# EAGLE schematic openSX70_OUTLINE_SONAR_8_20190606B (EAGLE 9.3.2)
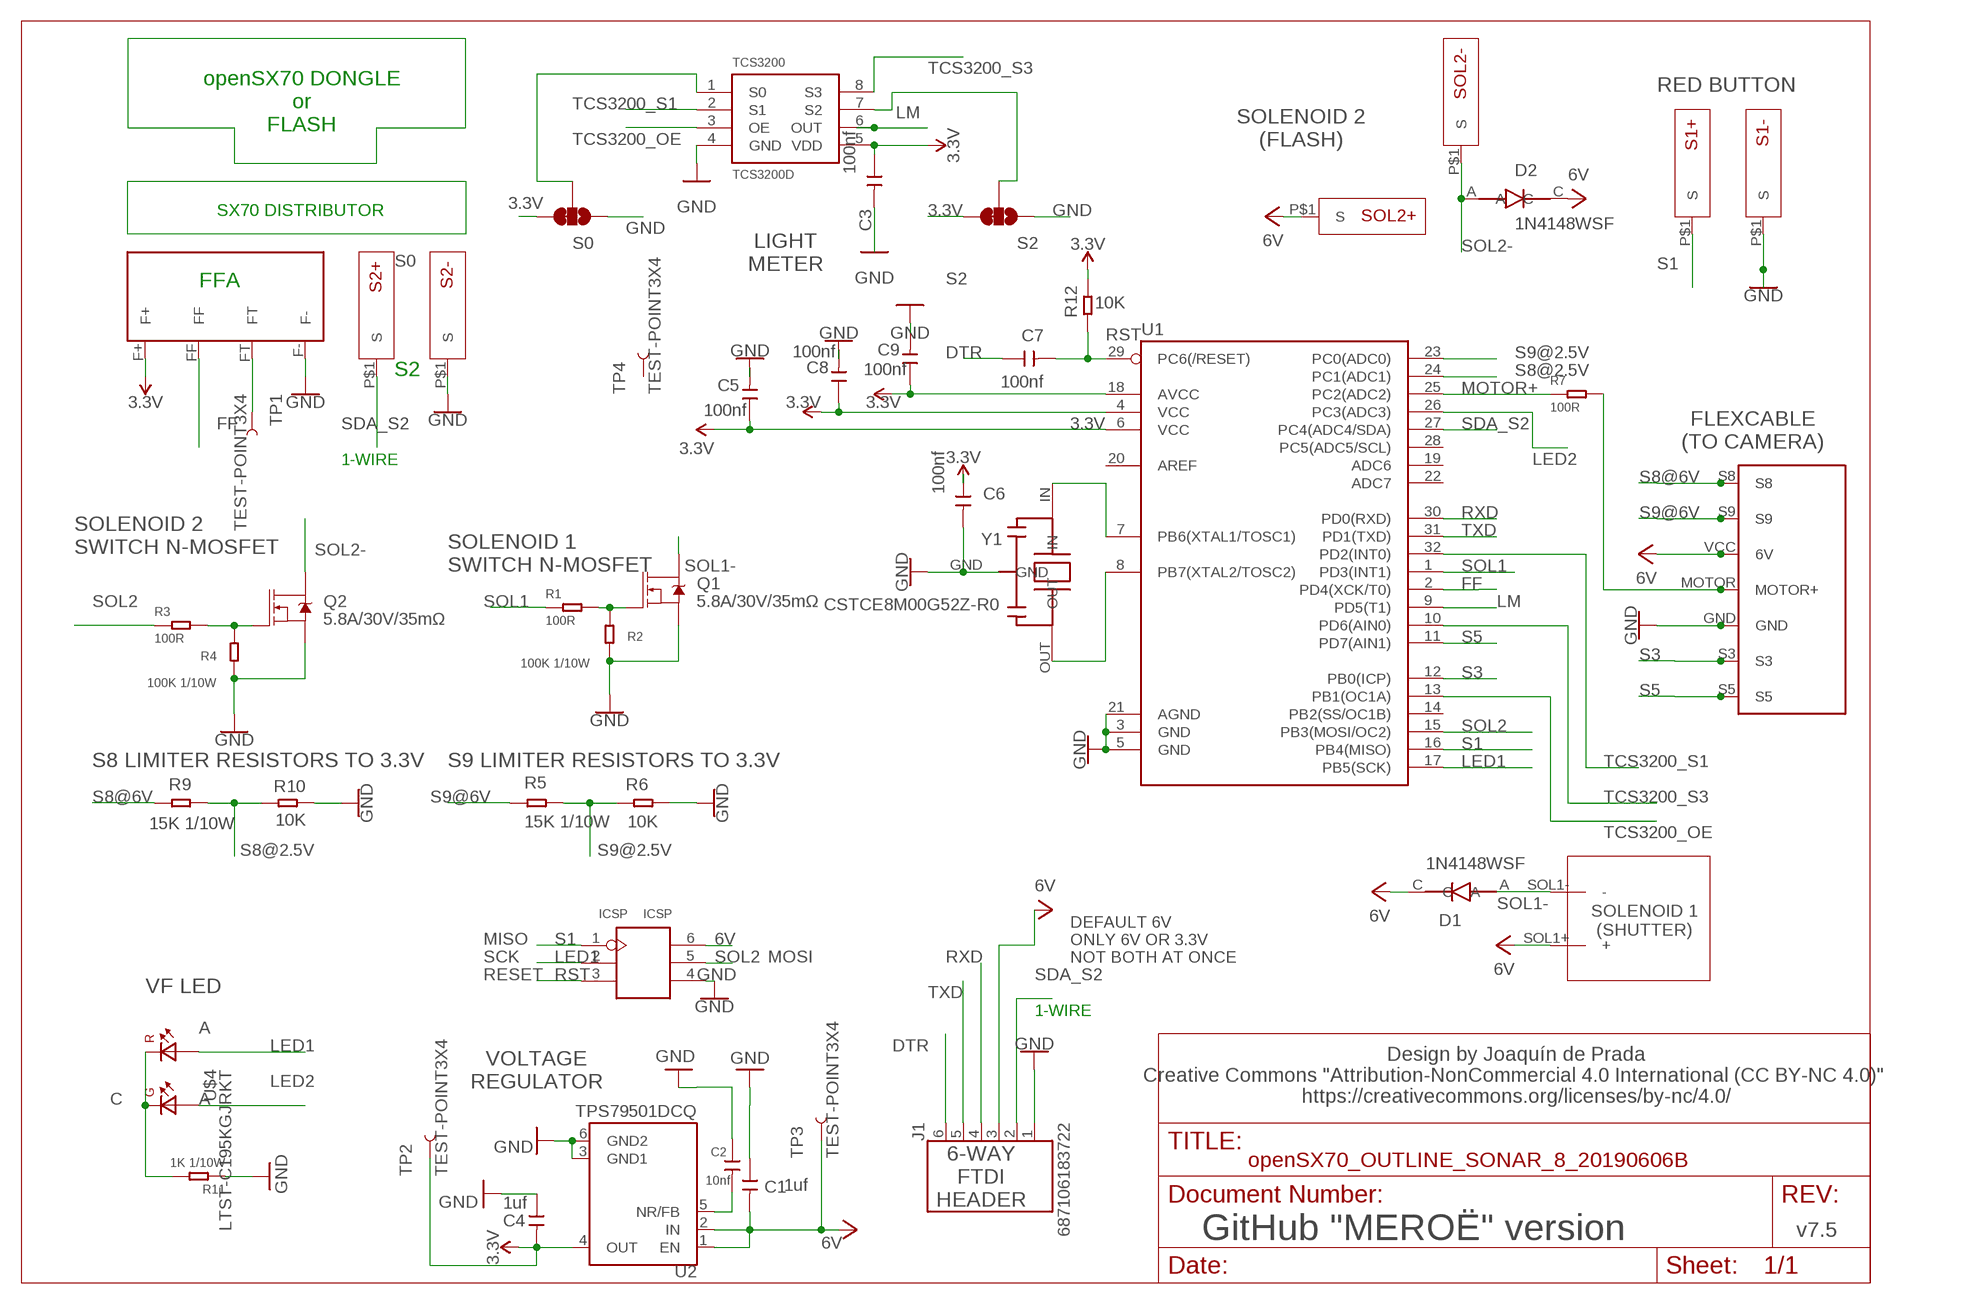
[diagram p0: schematic, sheet 1]

## Parts
C1  1uf  CERAMIC-10UF-10V-10%-X5R(0603)  [C0603]
C2  10nf  CERAMIC-100NF-50V-10%-X7R(0603)  [C0603]
C3  100nf  CERAMIC-100NF-50V-10%-X7R(0603)  [C0603]
C4  1uf  CERAMIC-10UF-10V-10%-X5R(0603)  [C0603]
C5  100nf  CERAMIC-100NF-50V-10%-X7R(0603)  [C0603]
C6  100nf  CERAMIC-100NF-50V-10%-X7R(0603)  [C0603]
C7  100nf  CERAMIC-100NF-50V-10%-X7R(0603)  [C0603]
C8  100nf  CERAMIC-100NF-50V-10%-X7R(0603)  [C0603]
C9  100nf  CERAMIC-100NF-50V-10%-X7R(0603)  [C0603]
D1  1N4148WSF  1N4148WS  [SODFL2512X100N]
D2  1N4148WSF  1N4148WS  [SODFL2512X100N]
ICSP  ICSP  [H2X3-2.54]
J1  687106183722  [687106183722]
Q1  5.8A/30V/35mΩ  MOSFET-NCH-AO3404A  [SOT23-3]
Q2  5.8A/30V/35mΩ  MOSFET-NCH-AO3404A  [SOT23-3]
R1  100R  SMD-RES-100R-5%-1/10W(0603)  [R0603]
R2  100K 1/10W  SMD-RES-100K-5%-1/10W(0603)  [R0603]
R3  100R  SMD-RES-100R-5%-1/10W(0603)  [R0603]
R4  100K 1/10W  SMD-RES-100K-5%-1/10W(0603)  [R0603]
R5  15K 1/10W  SMD-RES-15K-1%-1/10W(0603)  [R0603]
R6  10K  SMD-RES-10K-1%-1/10W(0603)  [R0603]
R7  100R  SMD-RES-100R-5%-1/10W(0603)  [R0603]
R9  15K 1/10W  SMD-RES-15K-1%-1/10W(0603)  [R0603]
R10  10K  SMD-RES-10K-1%-1/10W(0603)  [R0603]
R11  1K 1/10W  SMD-RES-1K-5%-1/10W(0603)  [R0603]
R12  10K  SMD-RES-10K-1%-1/10W(0603)  [R0603]
S0  S0  JUMPER-SMT_3_1-NC_TRACE_SILK  [SMT-JUMPER_3_1-NC_TRACE_SILK]
S1+  SX70-S-PAD-NEW  [SX70-S-PAD2]
S1-  SX70-S-PAD-NEW  [SX70-S-PAD2]
S2  S2  JUMPER-SMT_3_1-NC_TRACE_SILK  [SMT-JUMPER_3_1-NC_TRACE_SILK]
S2+  SX70-S-PAD-NEW  [SX70-S-PAD2]
S2-  SX70-S-PAD-NEW  [SX70-S-PAD2]
SOL1  SX70-SOLENOID1-2PADS  [SX70-SOLENOID1-2]
SOL2+  SX70-S-PAD-NEW  [SX70-S-PAD2]
SOL2-  SX70-S-PAD-NEW  [SX70-S-PAD2]
TCS3200  TCS3200D  [SOIC8]
TP1  TEST-POINT3X4  [PAD.03X.04]
TP2  TEST-POINT3X4  [PAD.03X.04]
TP3  TEST-POINT3X4  [PAD.03X.04]
TP4  TEST-POINT3X4  [PAD.03X.04]
U1  ATMEGA328P_32MLFATMEGA328-MLF  [MLF32]
U2  TPS79501DCQ  [SOT127P706X180-6N]
U$1  SX70-7-PAD  [SX70-7-PAD-PROPER]
U$2  FFA  SX70-FFA-PAD  [FFA-PAD-PACKAGE]
U$4  LTST-C195KGJRKT  [LTST-BILED-15X16]
Y1  CSTCE8M00G52Z-R0  CSTCE16M0V53-R0  [CFP95P160X100-3N]

## Nets
3.3V: C3.1 C4.2 C5.1 C6.1 C8.1 C9.1 R12.2 S0.3 S2.3 TCS3200.5(VDD) TP2.P$1 U1.4(VCC) U1.6(VCC) U1.18(AVCC) U2.4(OUT) U$2.F+
6V: C1.2 D1.C D2.C ICSP.6(VCC) J1.3 SOL1.SOL1+(+) SOL2+.P$1(S) TP3.P$1 U2.1(EN) U2.2(IN) U$1.VCC(6V)
DTR: C7.1 J1.6
FF: U1.2(PD4(XCK/T0)) U$2.FF
GND: C1.1 C2.1 C3.2 C4.1 C5.2 C6.2 C8.2 C9.2 ICSP.4(GND) J1.1 Q1.2(S) Q2.2(S) R2.1 R4.1 R6.2 R10.2 R11.1 S0.1 S1-.P$1(S) S2-.P$1(S) S2.1 TCS3200.4(GND) U1.3(GND) U1.5(GND) U1.21(AGND) U2.3(GND1) U2.6(GND2) U$1.GND U$2.F- Y1.GND
LED1: ICSP.2(SCK) U1.17(PB5(SCK)) U$4.P$2(A2)
LED2: U1.26(PC3(ADC3)) U$4.P$1(A1)
LM: TCS3200.6(OUT) U1.9(PD5(T1))
MOTOR+: R7.1 U1.25(PC2(ADC2))
MOTOR-HEADER: R7.2 U$1.MOTOR(MOTOR+)
N$1: Q1.1(G) R1.2 R2.2
N$3: Q2.1(G) R3.2 R4.2
N$4: U1.7(PB6(XTAL1/TOSC1)) Y1.IN
N$5: TP1.P$1 U$2.FT
N$6: U1.8(PB7(XTAL2/TOSC2)) Y1.OUT
N$7: S0.2 TCS3200.1(S0)
N$8: S2.2 TCS3200.7(S2)
N$10: C2.2 U2.5(NR/FB)
N$11: R11.2 U$4.P$3(K1) U$4.P$4(K2)
RST: C7.2 ICSP.3(RST) R12.1 U1.29(PC6(/RESET))
RXD: J1.4 U1.30(PD0(RXD))
S1: ICSP.1(MISO) S1+.P$1(S) U1.16(PB4(MISO))
S3: U1.12(PB0(ICP)) U$1.S3
S5: U1.11(PD7(AIN1)) U$1.S5
S8@2.5V: R9.2 R10.1 U1.24(PC1(ADC1))
S8@6V: R9.1 U$1.S8
S9@2.5V: R5.2 R6.1 U1.23(PC0(ADC0))
S9@6V: R5.1 U$1.S9
SDA_S2: J1.2 S2+.P$1(S) U1.27(PC4(ADC4/SDA))
SOL1: R1.1 U1.1(PD3(INT1))
SOL1-: D1.A Q1.3(D) SOL1.SOL1-(-)
SOL2: ICSP.5(MOSI) R3.1 U1.15(PB3(MOSI/OC2))
SOL2-: D2.A Q2.3(D) SOL2-.P$1(S)
TCS3200_OE: TCS3200.3(OE) U1.13(PB1(OC1A))
TCS3200_S1: TCS3200.2(S1) U1.32(PD2(INT0))
TCS3200_S3: TCS3200.8(S3) U1.10(PD6(AIN0))
TXD: J1.5 U1.31(PD1(TXD))
Unconnected: TP4.P$1 U1.14(PB2(SS/OC1B)) U1.19(ADC6) U1.20(AREF) U1.22(ADC7) U1.28(PC5(ADC5/SCL))

## Notes on the sheet
- RED BUTTON
- openSX70 DONGLE
  or
  FLASH
- SOLENOID 2
  (FLASH)
- SX70 DISTRIBUTOR
- LIGHT
  METER
- FFA
- S2
- FLEXCABLE
  (TO CAMERA)
- 1-WIRE
- SOLENOID 2
  SWITCH N-MOSFET
- SOLENOID 1
  SWITCH N-MOSFET
- S8 LIMITER RESISTORS TO 3.3V | S9 LIMITER RESISTORS TO 3.3V
- SOLENOID 1
  (SHUTTER)
- MISO
- SCK | MOSI
- RESET
- DEFAULT 6V
  ONLY 6V OR 3.3V
  NOT BOTH AT ONCE
- VF LED | 1-WIRE
- A
- VOLTAGE
  REGULATOR
- Design by Joaquín de Prada
  Creative Commons "Attribution-NonCommercial 4.0 International (CC BY-NC 4.0)" 
  https://creativecommons.org/licenses/by-nc/4.0/
- C | A
- 6-WAY
  FTDI
  HEADER
- v7.5
- GitHub "MEROË" version

## Library data of the parts
C1 C4 = Seeed-Capacitor:CERAMIC-10UF-10V-10%-X5R(0603): 302010103; MPN: CC0603KRX5R6BB106; VALUE: 10uf
C2 = Seeed-Capacitor:CERAMIC-100NF-50V-10%-X7R(0603): 302010138; MPN: CC0603KRX7R9BB104; VALUE: 100nf
C3 C5-C9 = Seeed-Capacitor:CERAMIC-100NF-50V-10%-X7R(0603): 302010138; MPN: CC0603KRX7R9BB104
D1 D2 = Common-Parts-Library-Eagle:1N4148WS: 1N4148WS Series 75 V 300 mA Surface Mount Small Signal Diodes - SOD-323F; MANUFACTURER: Fairchild Semiconductor
ICSP = openSX70:ICSP
J1 = 687106183722:687106183722: 687106183722 WR-FPC 0.50mm SMT Horizontal Bottom Contact - Low Profile <http://katalog.we-online.de/media/images/v2/Family_WR-FPC_6871xx183722.jpg> Details see: http://katalog.we-online.de/en/em/FPC_0_5_SMT_ZIF_HORIZONTAL_BOTTOM_CONTACT_LOW_PROFILE_6871xx183722 Created by Yingchun,shan 2016 (C) Wurth Elektronik; AVAILABILITY: Good; DESCRIPTION: CONN FFC BTM 6POS 0.5MM SMD R/A; MF: Wurth Electronics; MP: 687106183722; PACKAGE: None; PRICE: 1.21 USD
Q1 Q2 = openSX70:MOSFET-NCH: N-channel MOSFETs Voltage controlled devices that allow control of high current outputs. SparkFun Products: SparkFun OpenScale <https://www.sparkfun.com/products/13261> SparkFun Digital Sandbox <https://www.sparkfun.com/products/12651> SparkFun Monster Moto Shield <https://www.sparkfun.com/products/10182> SparkFun MOSFET Power Controller <https://www.sparkfun.com/products/11214>; PROD_ID: TRANS-12988
R1 R3 R7 = Seeed-Resistor:SMD-RES-100R-5%-1/10W(0603): 301010090; MPN: RC0603JR-07100RL
R2 R4 = Seeed-Resistor:SMD-RES-100K-5%-1/10W(0603): 301010089; MPN: RC0603JR-07100KL
R5 R9 = Seeed-Resistor:SMD-RES-15K-1%-1/10W(0603): 301010241; MPN: RC0603FR-0715KL
R6 R10 R12 = Seeed-Resistor:SMD-RES-10K-1%-1/10W(0603): 301010299; MPN: RC0603FR-0710KL
R11 = Seeed-Resistor:SMD-RES-1K-5%-1/10W(0603): 301010291; MPN: RC0603JR-071KL
S0 S2 = SparkFun-Jumpers:JUMPER-SMT_3_1-NC_TRACE: Normally closed trace jumper (1 of 2 connections) This jumper has a trace between two pads so it's normally closed (NC). The other connection is normally open (NO). Use a razor knife to open the connection. For best results follow the IPC guidelines for cutting traces: Cutout at least 0.063 mm (0.005 in). Remove all loose material to clean up the cut area. Seal the cut with an approved epoxy. Reapply solder to reclose the connection, or to close the NO connection.
S1+ S1- S2+ S2- SOL2+ SOL2- = openSX70:SX70-S-PAD-NEW
SOL1 = openSX70:SX70-SOLENOID1-2PADS
TCS3200 = TCS3200D:TCS3200D; AVAILABILITY: Unavailable; DESCRIPTION: TSL3200 Series 5.5 V Programmable Color Light-To-Frequency Converter - SOIC-8; MF: ams; MP: TCS3200D-TR; PACKAGE: SOIC-8 ams; PRICE: None
TP1-TP4 = SparkFun-Connectors:TEST-POINT: SparkFun Test Points Bare copper test points for troubleshooting or In-Circuit-Testing. These are used by our Production team for verifying production board runs using pogo-pins on test beds. SparkFun Products: SparkFun LSM9DS1 Breakout <https://www.sparkfun.com/products/13284> SparkFun PSOC <https://www.sparkfun.com/products/13714> SparkFun Load Cell Amplifier <https://www.sparkfun.com/products/13879>
U1 = _openSX70:ATMEGA328P_32MLF: Popular 328P in QFP Storefront component: ATmega328 - TQFP <https://www.sparkfun.com/products/13448> (COM-13448) Datasheet <http://www.sparkfun.com/datasheets/Components/SMD/ATMega328.pdf> SparkFun Products SparkFun RedBoard - Programmed with Arduino <https://www.sparkfun.com/products/12757> (DEV-12757) Arduino Pro Mini 328 - 5V/16MHz <https://www.sparkfun.com/products/11113> (DEV-11113) Arduino Pro Mini 328 - 3.3V/8MHz <https://www.sparkfun.com/products/11114> (DEV-11114) SparkFun OpenLog <https://www.sparkfun.com/products/13712> (DEV-13712) SparkFun MicroView - OLED Arduino Module <https://www.sparkfun.com/products/12923> (DEV-12923) SparkFun Digital Sandbox <https://www.sparkfun.com/products/12651> (DEV-12651) SparkFun PicoBoard <https://www.sparkfun.com/products/11888> (WIG-11888) Arduino Fio <https://www.sparkfun.com/products/10116> (DEV-10116) LilyPad Arduino 328 Main Board <https://www.sparkfun.com/products/13342> (DEV-13342) SparkFun RedStick <https://www.sparkfun.com/products/13741> (DEV-13741) LilyPad MP3 <https://www.sparkfun.com/products/11013> (DEV-11013) LilyPad Arduino SimpleSnap <https://www.sparkfun.com/products/10941> (DEV-10941) SparkFun Stepoko <https://www.sparkfun.com/products/13899> (ROB-13899) SparkFun Geiger Counter <https://www.sparkfun.com/products/11345> (SEN-11345) SparkFun EL Sequencer <https://www.sparkfun.com/products/12781> (COM-12781) Arduino Pro 328 - 5V/16MHz <https://www.sparkfun.com/products/10915> (DEV-10915) CryptoCape <https://www.sparkfun.com/products/12773> (DEV-12773) SparkFun IR Thermometer Evaluation Board - MLX90614 <https://www.sparkfun.com/products/10740> (SEN-10740) SparkFun RedBot Mainboard <https://www.sparkfun.com/products/12097> (ROB-12097) Arduino Pro 328 - 3.3V/8MHz <https://www.sparkfun.com/products/10914> (DEV-10914) SparkFun Block for Intel® Edison - Arduino <https://www.sparkfun.com/products/13036> (DEV-13036) SparkFun Simon Says - Surface Mount Soldering Kit <https://www.sparkfun.com/products/10935> (KIT-10935) SparkFun 7-Segment Serial Display - Red <https://www.sparkfun.com/products/11441> (COM-11441) SparkFun 7-Segment Serial Display - White <https://www.sparkfun.com/products/11629> (COM-11629) SparkFun 7-Segment Serial Display - Yellow <https://www.sparkfun.com/products/11443> (COM-11443) SparkFun 7-Segment Serial Display - Kelly Green <https://www.sparkfun.com/products/11440> (COM-11440) SparkFun 7-Segment Serial Display - Blue <https://www.sparkfun.com/products/11442> (COM-11442) SparkFun OpenSegment Serial Display - 20mm (Blue) <https://www.sparkfun.com/products/11647> (COM-11647) SparkFun OpenSegment Serial Display - 20mm (Green) <https://www.sparkfun.com/products/11646> (COM-11646) SparkFun OpenSegment Serial Display - 20mm (White) <https://www.sparkfun.com/products/11648> (COM-11648) SparkFun OpenSegment Serial Display - 20mm (Red) <https://www.sparkfun.com/products/11644> (COM-11644) SparkFun OpenSegment Serial Display - 20mm (Yellow) <https://www.sparkfun.com/products/11645> (COM-11645) SparkFun OpenSegment Shield <https://www.sparkfun.com/products/13190> (DEV-13190)
U2 = TPS79501DCQ:TPS79501DCQ: Ultralow-Noise, High-PSRR, Fast, RF, 500-mA Low-Dropout Linear Regulators 6-SOT-223 -40 to 125; AVAILABILITY: Unavailable; DESCRIPTION: Ultralow-Noise, High-PSRR, Fast, RF, 500-mA Low-Dropout Linear Regulators 6-SOT-223 -40 to 125; MF: Texas Instruments; MP: TPS79501DCQ; PACKAGE: SOT-223-6 Texas Instruments; PRICE: None
U$1 = _openSX70:SX70-7-PAD
U$2 = openSX70:SX70-FFA-PAD
U$4 = LTST-C195KGJRKT:LTST-C195KGJRKT; AVAILABILITY: Unavailable; DESCRIPTION: Green/Red 130° Water Clear 35/25 mcd 2 V 0605 Surface Mount Bi-Color LED; MF: Lite-On Inc.; MP: LTST-C195KGJRKT; PACKAGE: 0606 Lite-On; PRICE: None
Y1 = CSTCE16M0V53-R0:CSTCE16M0V53-R0: Ceramic Resonator 16MHz ±0.5% (Tol) ±0.3% (Stability) 15pF 40Ohm 3-Pin CSMD T/R; AVAILABILITY: Good; DESCRIPTION: Ceramic Resonator 16MHz ??0.5% (Tol) ??0.3% (Stability) 15pF 40Ohm 3-Pin CSMD T/R; MF: Murata; MP: CSTCE16M0V53-R0; PACKAGE: SMD-3 Murata; PRICE: 0.28 USD

## Net classes
0 default: width 0.254 mm
1 GND: width 0.61 mm